# Altium schematic sheet IMU.SchDoc: Motherboard-IMU
size A4; Author: Patryk Bujak; DrawnBy: Patryk Bujak; DocumentNumber: 12; Revision: 1.0; SheetNumber: 7; SheetTotal: 10
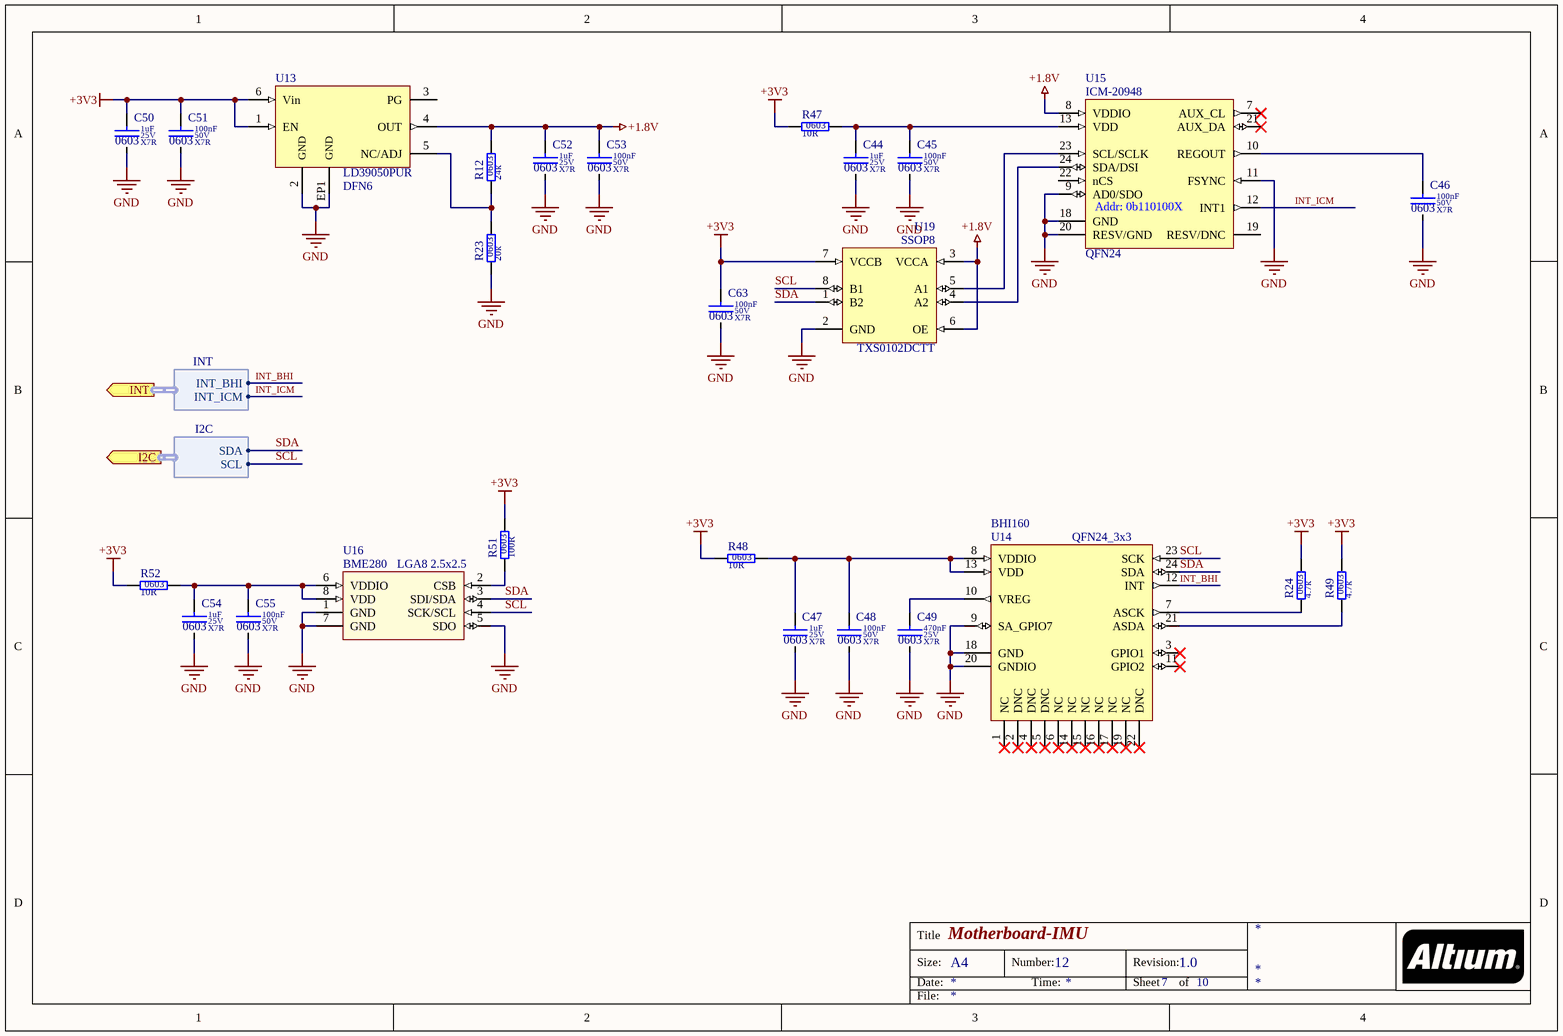
[diagram p0: IMU.SchDoc]

## Parts
C44  value 1uF  Dielectric: X7R  Voltage: 25V  SCH_Footprint: 0603  [C_0603_1608]  (hidden comment: Ceramic X7R)
C45  value 100nF  Dielectric: X7R  Voltage: 50V  SCH_Footprint: 0603  [C_0603_1608]  (hidden comment: Ceramic X7R)
C46  value 100nF  Dielectric: X7R  Voltage: 50V  SCH_Footprint: 0603  [C_0603_1608]  (hidden comment: Ceramic X7R)
C47  value 1uF  Dielectric: X7R  Voltage: 25V  SCH_Footprint: 0603  [C_0603_1608]  (hidden comment: Ceramic X7R)
C48  value 100nF  Dielectric: X7R  Voltage: 50V  SCH_Footprint: 0603  [C_0603_1608]  (hidden comment: Ceramic X7R)
C49  value 470nF  Dielectric: X7R  Voltage: 25V  SCH_Footprint: 0603  [C_0603_1608]  (hidden comment: Ceramic X7R)
C50  value 1uF  Dielectric: X7R  Voltage: 25V  SCH_Footprint: 0603  [C_0603_1608]  (hidden comment: Ceramic X7R)
C51  value 100nF  Dielectric: X7R  Voltage: 50V  SCH_Footprint: 0603  [C_0603_1608]  (hidden comment: Ceramic X7R)
C52  value 1uF  Dielectric: X7R  Voltage: 25V  SCH_Footprint: 0603  [C_0603_1608]  (hidden comment: Ceramic X7R)
C53  value 100nF  Dielectric: X7R  Voltage: 50V  SCH_Footprint: 0603  [C_0603_1608]  (hidden comment: Ceramic X7R)
C54  value 1uF  Dielectric: X7R  Voltage: 25V  SCH_Footprint: 0603  [C_0603_1608]  (hidden comment: Ceramic X7R)
C55  value 100nF  Dielectric: X7R  Voltage: 50V  SCH_Footprint: 0603  [C_0603_1608]  (hidden comment: Ceramic X7R)
C63  value 100nF  Dielectric: X7R  Voltage: 50V  SCH_Footprint: 0603  [C_0603_1608]  (hidden comment: Ceramic X7R)
R12  value 24k  SCH_Footprint: 0603  [R_0603_1608]  (hidden comment: Resistor)
R23  value 20k  SCH_Footprint: 0603  [R_0603_1608]  (hidden comment: Resistor)
R24  value 4.7k  SCH_Footprint: 0603  [R_0603_1608]  (hidden comment: Resistor)
R47  value 10R  SCH_Footprint: 0603  [R_0603_1608]  (hidden comment: Resistor)
R48  value 10R  SCH_Footprint: 0603  [R_0603_1608]  (hidden comment: Resistor)
R49  value 4.7k  SCH_Footprint: 0603  [R_0603_1608]  (hidden comment: Resistor)
R51  value 100R  SCH_Footprint: 0603  [R_0603_1608]  (hidden comment: Resistor)
R52  value 10R  SCH_Footprint: 0603  [R_0603_1608]  (hidden comment: Resistor)
U13  SCH_Footprint: DFN6  [DFN6_3x3]  (hidden comment: LD39050PUR)
U14  value BHI160  [QFN24_3x3]  (hidden comment: Three Axis Ultra Low Power Sensor Hub - LGA-24)
U15  value ICM-20948  SCH_Footprint: QFN24  [QFN24_3x3]  (hidden comment: 9-Axis MEMS MotionTracking Device)
U16  value BME280  SCH_Footprint: LGA8 2.5x2.5  [LGA8_2.5x2.5]  (hidden comment: Combined humidity and pressure sensor)
U19  value TXS0102DCTT  SCH_Footprint: SSOP8  [SSOP8_3x3]  (hidden comment: 2-Bit Bidirectional Voltage-Level Shifter for Open-Drain and Push-Pull Application 8-VSSOP -40 to 85)

## Ports
I2C (out, harness I2C), INT (out, harness INT)

## Harnesses
I2C: SDA, SCL
INT: INT_BHI, INT_ICM

## Nets
+1.8V: C52.1 C53.1 R12.2 U13.4(OUT) U15.8(VDDIO) U19.3(VCCA) U19.6(OE)
+3V3: C50.1 C51.1 C63.1 R24.2 R47.1 R48.1 R49.2 R51.2 R52.1 U13.1(EN) U13.6(Vin) U19.7(VCCB)
GND: C44.2 C45.2 C46.2 C47.2 C48.2 C49.2 C50.2 C51.2 C52.2 C53.2 C54.2 C55.2 C63.2 R23.1 U13.2(GND) U13.EP1(GND) U14.9(SA_GPIO7) U14.18(GND) U14.20(GNDIO) U15.9(AD0/SDO) U15.11(FSYNC) U15.18(GND) U15.20(RESV/GND) U16.1(GND) U16.5(SDO) U16.7(GND) U19.2(GND)
INT_BHI: U14.12(INT) ; port INT.INT_BHI
INT_ICM: U15.12(INT1) ; port INT.INT_ICM
SCL: U14.23(SCK) U16.4(SCK/SCL) U19.8(B1) ; port I2C.SCL
SDA: U14.24(SDA) U16.3(SDI/SDA) U19.1(B2) ; port I2C.SDA
NetC44_1: C44.1 C45.1 R47.2 U15.13(VDD)
NetC46_1: C46.1 U15.10(REGOUT)
NetC47_1: C47.1 C48.1 R48.2 U14.8(VDDIO) U14.13(VDD)
NetC49_1: C49.1 U14.10(VREG)
NetC54_1: C54.1 C55.1 R52.2 U16.6(VDDIO) U16.8(VDD)
NetR12_1: R12.1 R23.2 U13.5(NC/ADJ)
NetR24_1: R24.1 U14.7(ASCK)
NetR49_1: R49.1 U14.21(ASDA)
NetR51_1: R51.1 U16.2(CSB)
NetU15_23: U15.23(SCL/SCLK) U19.5(A1)
NetU15_24: U15.24(SDA/DSI) U19.4(A2)

Not connected (* = marked no-connect by the designer): U13 3(PG); U14 1(NC)* 2(DNC)* 3(GPIO1)* 4(DNC)* 5(DNC)* 6(NC)* 11(GPIO2)* 14(NC)* 15(NC)* 16(NC)* 17(NC)* 19(NC)* 22(DNC)*; U15 1(DNC) 2(DNC) 3(DNC) 4(DNC) 5(DNC) 6(DNC) 7(AUX_CL)* 14(DNC) 15(DNC) 16(DNC) 17(DNC) 19(RESV/DNC) 21(AUX_DA)* 22(nCS)

## Notes on the sheet
- Title
- Size:
- Date:
- A4
- Number:
- Time:
- Revision:
- Sheet
- of
- File:
- (in symbol U_ICM-20948) Addr: 0b110100X

## Library data of the parts
C44 C47 C50 C52 C54 = C_1uF_25V_X7R_0603_10: Capacitor; Manufacturer: Samsung; Manufacturer Part Number: CL10B105KA8NNNC; Tolerance (%): 10; Part Number: C_1uF_25V_X7R_0603_10; HelpURL: http://www.tme.eu/pl/Document/4a42202b32dab16128fe107dd69598cc/samsung-chip-cap.pdf; Supplier 1: TME; Supplier Part Number 1: CL10B105KA8NNNC; Supplier 2: RS Components; Supplier 3: Farnell; Supplier 4: Mouser; Supplier 5: Digi-Key; Supplier 6: LCSC
C45 C46 C48 C51 C53 C55 C63 = C_100nF_50V_X7R_0603_5: Capacitor; Manufacturer: Samsung; Manufacturer Part Number: CL10B104JB8NNNC; Tolerance (%): 5; Part Number: C_100nF_50V_X7R_0603_5; HelpURL: http://www.tme.eu/pl/Document/4a42202b32dab16128fe107dd69598cc/samsung-chip-cap.pdf; Supplier 1: TME; Supplier Part Number 1: CL10B104JB8NNNC; Supplier 2: RS Components; Supplier Part Number 2: 7665455; Supplier 3: Farnell; Supplier 4: Mouser; Supplier 5: Digi-Key; Supplier Part Number 5: 1276-1033-1-ND; Supplier 6: LCSC; Supplier Part Number 6: C24452
C49 = C_470nF_25V_X7R_0603_10: Capacitor; Manufacturer: Murata; Manufacturer Part Number: GRM188R71E474KA12D; Tolerance (%): 10; Part Number: C_470nF_25V_X7R_0603_10; HelpURL: http://www.farnell.com/datasheets/2048708.pdf; Supplier 1: TME; Supplier 2: RS Components; Supplier Part Number 2: 7235654; Supplier 3: Farnell; Supplier Part Number 3: 1828901; Supplier 4: Mouser; Supplier Part Number 4: 81-GRM188R71E474KA12; Supplier 5: Digi-Key; Supplier Part Number 5: 490-3291-1-ND; Supplier 6: LCSC
R12 = R_24k_0603_1: Manufacturer: Vishay; Manufacturer Part Number: CRCW060324K0FKTABC; Voltage: 75V; Power: 100mW; Tolerance: 1%; Part Number: R_24k_0603_1; HelpURL: http://www.tme.eu/pl/Document/622e28308c06d160637f2b14751ba16b/Data%20Sheet%20CRCW_BCe3.pdf; Supplier 1: TME; Supplier Part Number 1: CRCW060324K0FKTABC; Supplier 2: RS Components; Supplier 3: Farnell; Supplier 4: Mouser; Supplier Part Number 4: 71-CRCW0603-24K; Supplier 5: Digi-Key; Supplier 6: LCSC
R23 = R_20k_0603_1: Manufacturer: Vishay; Manufacturer Part Number: CRCW060320K0FKTABC; Voltage: 75V; Power: 100mW; Tolerance: 1%; Part Number: R_20k_0603_1; HelpURL: https://www.tme.eu/pl/Document/622e28308c06d160637f2b14751ba16b/Data%20Sheet%20CRCW_BCe3.pdf; Supplier 1: TME; Supplier Part Number 1: CRCW060320K0FKTABC; Supplier 2: RS Components; Supplier 3: Farnell; Supplier 4: Mouser; Supplier Part Number 4: 71-CRCW0603-20K; Supplier 5: Digi-Key; Supplier 6: LCSC
R24 R49 = R_4.7k_0603_1: Manufacturer: Yageo; Manufacturer Part Number: RC0603FR-074K7L; Voltage: 75V; Power: 100mW; Tolerance: 1%; Part Number: R_4.7k_0603_1; HelpURL: http://www.farnell.com/datasheets/2167052.pdf?_ga=2.156163131.1690599162.1548417389-1379097396.1542296996&_gac=1.18389067.1547230258.Cj0KCQiAmuHhBRD0ARIsAFWyPwhX8HcvXnM3tA0ZBodZLzDIjH2ZxLpjT5LWo9bad_HPRbU8LfPq44UaAhEwEALw_wcB; Supplier 1: TME; Supplier Part Number 1: RC0603FR-074K7; Supplier 2: RS Components; Supplier 3: Farnell; Supplier Part Number 3: 9238565; Supplier 4: Mouser; Supplier Part Number 4: 603-RC0603FR-074K7L; Supplier 5: Digi-Key; Supplier Part Number 5: 311-4.70KHRCT-ND; Supplier 6: LCSC
R47 R48 R52 = R_10R_0603_1: Manufacturer: Royalohm; Manufacturer Part Number: 0603SAF100JT5E; Voltage: 50V; Power: 100mW; Tolerance: 1%; Part Number: R_10R_0603_1; HelpURL: http://www.tme.eu/pl/Document/b315665a56acbc42df513c99b390ad98/ROYALOHM-THICKFILM.pdf; Supplier 1: TME; Supplier Part Number 1: SMD0603-10R-1%; Supplier 2: RS Components; Supplier 3: Farnell; Supplier 4: Mouser; Supplier 5: Digi-Key; Supplier 6: LCSC
R51 = R_100R_0603_1: Manufacturer: Yageo; Manufacturer Part Number: RC0603FR-07100RL; Voltage: 50V; Power: 100mW; Tolerance: 1%; Part Number: R_100R_0603_1; HelpURL: http://www.tme.eu/en/Document/d2a72e545e5c8eb7bf2a04fa97535928/rc0603yageo.pdf; Supplier 1: TME; Supplier Part Number 1: RC0603FR-07100R; Supplier 2: RS Components; Supplier 3: Farnell; Supplier Part Number 3: 2131804; Supplier 4: Mouser; Supplier Part Number 4: 603-RC0603FR-07100RL; Supplier 5: Digi-Key; Supplier Part Number 5: 311-100HRCT-ND; Supplier 6: LCSC
U13 = VL_LD39050PUR: Manufacturer: STMicroelectronics; Voltage: ADJ; Current: 500mA; Value: LD39050PUR; Part Number: VL_LD39050PUR; HelpURL: https://pl.mouser.com/datasheet/2/389/ld39050-974080.pdf; Manufacturer Part Number: LD39050PUR; Supplier 1: TME; Supplier Part Number 1: LD39050PUR; Supplier 2: RS Components; Supplier Part Number 2: 8805317; Supplier 3: Farnell; Supplier Part Number 3: 2762704; Supplier 4: Mouser; Supplier Part Number 4: 511-LD39050PUR; Supplier 5: Digi-Key; Supplier Part Number 5: 497-8717-1-ND; Supplier 6: LCSC
U14 = U_BHI160: Manufacturer: Bosch Tools; SCH_Footprint: QFN24_3x3; Part Number: U_BHI160; HelpURL: https://datasheet.octopart.com/BHI160-Bosch-datasheet-66132459.pdf; Manufacturer Part Number: BHI160; Supplier 1: TME; Supplier 2: RS Components; Supplier 3: Farnell; Supplier 4: Mouser; Supplier Part Number 4: 262-BHI160; Supplier 5: Digi-Key; Supplier Part Number 5: 828-1067-1-ND; Supplier 6: LCSC
U15 = U_ICM-20948: Manufacturer: TDK; Part Number: U_ICM-20948; HelpURL: https://datasheet.octopart.com/ICM-20948-InvenSense-datasheet-115290367.pdf; Manufacturer Part Number: ICM-20948; Supplier 1: TME; Supplier 2: RS Components; Supplier 3: Farnell; Supplier Part Number 3: 2911498; Supplier 4: Mouser; Supplier Part Number 4: 410-ICM-20948; Supplier 5: Digi-Key; Supplier Part Number 5: 1428-1123-1-ND; Supplier 6: LCSC
U16 = U_BME280: Manufacturer: Bosch Tools; Part Number: U_BME280; HelpURL: https://cdn-shop.adafruit.com/datasheets/BST-BME280_DS001-10.pdf; Manufacturer Part Number: BME280; Supplier 1: TME; Supplier 2: RS Components; Supplier 3: Farnell; Supplier 4: Mouser; Supplier Part Number 4: 262-BME280; Supplier 5: Digi-Key; Supplier Part Number 5: 828-1063-1-ND; Supplier 6: LCSC
U19 = U_TXS0102DCTT: Manufacturer: Texas Instruments; Part Number: U_TXS0102DCTT; HelpURL: http://www.ti.com/lit/ds/symlink/txs0102.pdf; Manufacturer Part Number: TXS0102DCTT; Supplier 1: TME; Supplier 2: RS Components; Supplier Part Number 2: 7098912P; Supplier 3: Farnell; Supplier Part Number 3: 2098018; Supplier 4: Mouser; Supplier Part Number 4: 595-TXS0102DCTT; Supplier 5: Digi-Key; Supplier Part Number 5: 296-32603-1-ND; Supplier 6: LCSC